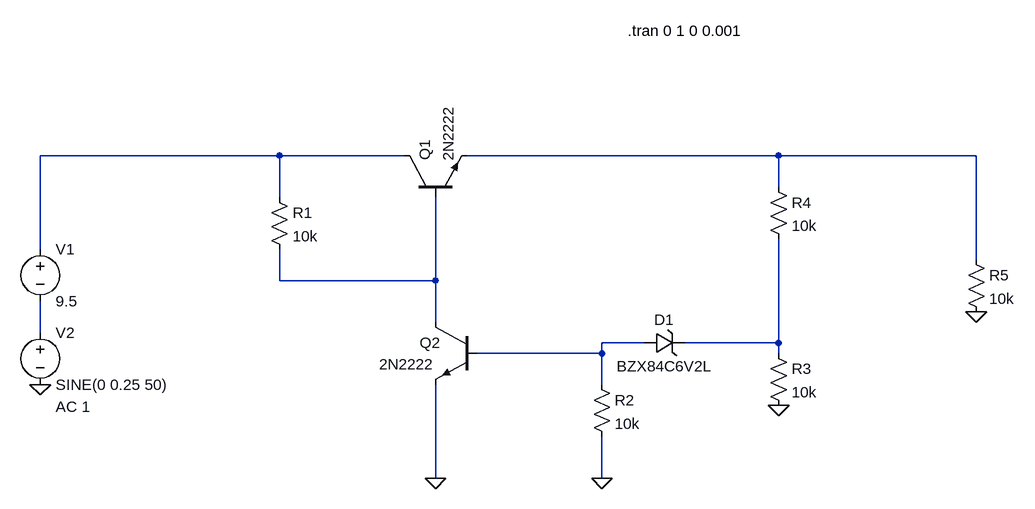
[diagram p0: schematic Regulador_mejorado.asc]
Regulador_mejorado.asc, the LTspice schematic file:
Version 4.1
SHEET 1 1548 680
WIRE 400 -16 32 -16
WIRE 592 -16 400 -16
WIRE 1168 -16 688 -16
WIRE 1472 -16 1168 -16
WIRE 1168 32 1168 -16
WIRE 400 48 400 -16
WIRE 32 128 32 -16
WIRE 1472 144 1472 -16
WIRE 400 176 400 128
WIRE 640 176 640 48
WIRE 640 176 400 176
WIRE 640 240 640 176
WIRE 32 256 32 208
WIRE 960 272 896 272
WIRE 1168 272 1168 112
WIRE 1168 272 1024 272
WIRE 896 288 896 272
WIRE 896 288 704 288
WIRE 1168 288 1168 272
WIRE 896 336 896 288
WIRE 640 480 640 336
WIRE 896 480 896 416
FLAG 32 336 0
FLAG 640 480 0
FLAG 1472 224 0
FLAG 896 480 0
FLAG 1168 368 0
SYMBOL voltage 32 112 R0
WINDOW 123 0 0 Left 0
WINDOW 39 0 0 Left 0
SYMATTR InstName V1
SYMATTR Value 9.5
SYMBOL voltage 32 240 R0
WINDOW 123 24 130 Left 2
WINDOW 39 0 0 Left 0
SYMATTR Value2 AC 1
SYMATTR InstName V2
SYMATTR Value SINE(0 0.25 50)
SYMBOL res 384 32 R0
SYMATTR InstName R1
SYMATTR Value 10k
SYMBOL npn 592 48 R270
SYMATTR InstName Q1
SYMATTR Value 2N2222
SYMBOL npn 704 240 M0
WINDOW 3 66 65 Left 2
SYMATTR Value 2N2222
SYMATTR InstName Q2
SYMBOL res 880 320 R0
SYMATTR InstName R2
SYMATTR Value 10k
SYMBOL res 1152 272 R0
SYMATTR InstName R3
SYMATTR Value 10k
SYMBOL res 1152 16 R0
SYMATTR InstName R4
SYMATTR Value 10k
SYMBOL res 1456 128 R0
SYMATTR InstName R5
SYMATTR Value 10k
SYMBOL zener 960 288 R270
WINDOW 0 36 32 VTop 2
WINDOW 3 -4 32 VBottom 2
SYMATTR InstName D1
SYMATTR Value BZX84C6V2L
TEXT 936 -208 Left 2 !.tran 0 1 0 0.001

The netlist it stands for:
* Regulador_mejorado.asc
V1 N001 N004 9.5
V2 N004 0 SINE(0 0.25 50) AC 1
R1 N001 N003 10k
Q1 N001 N003 N002 0 2N2222
Q2 N003 N005 0 0 2N2222
R2 N005 0 10k
R3 N006 0 10k
R4 N002 N006 10k
R5 N002 0 10k
D1 N005 N006 BZX84C6V2L
.model D D
.lib standard.dio
.model NPN NPN
.model PNP PNP
.lib standard.bjt
.tran 0 1 0 0.001
.backanno
.end